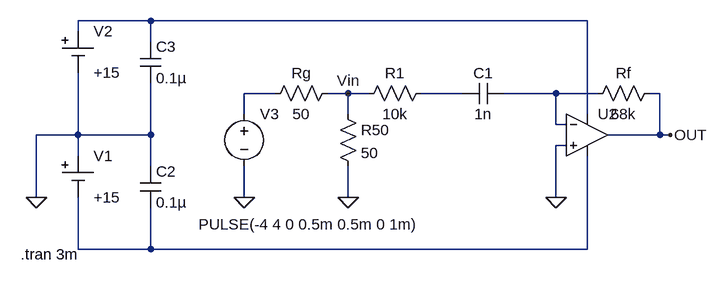
[diagram p0: schematic Circuito2.asc]
Circuito2.asc, the LTspice schematic file:
Version 4
SHEET 1 880 680
WIRE -160 -16 -272 -16
WIRE 512 -16 -160 -16
WIRE -272 0 -272 -16
WIRE -160 16 -160 -16
WIRE 32 96 -16 96
WIRE 144 96 112 96
WIRE 176 96 144 96
WIRE 320 96 256 96
WIRE 464 96 384 96
WIRE 528 96 464 96
WIRE 624 96 608 96
WIRE -16 128 -16 96
WIRE 144 128 144 96
WIRE 512 128 512 -16
WIRE 464 144 464 96
WIRE 480 144 464 144
WIRE -272 160 -272 64
WIRE -272 160 -336 160
WIRE -160 160 -160 80
WIRE -160 160 -272 160
WIRE 624 160 624 96
WIRE 624 160 544 160
WIRE 640 160 624 160
WIRE 480 176 464 176
WIRE -272 192 -272 160
WIRE -160 208 -160 160
WIRE -336 256 -336 160
WIRE -16 256 -16 208
WIRE 144 256 144 208
WIRE 464 256 464 176
WIRE -272 336 -272 256
WIRE -160 336 -160 272
WIRE -160 336 -272 336
WIRE 512 336 512 192
WIRE 512 336 -160 336
FLAG -16 256 0
FLAG 464 256 0
FLAG 144 256 0
FLAG -336 256 0
FLAG 144 96 Vin
FLAG 640 160 OUT
SYMBOL cap -176 208 R0
SYMATTR InstName C2
SYMATTR Value 0.1µ
SYMBOL Misc\\cell -272 192 R0
WINDOW 123 0 0 Left 0
WINDOW 39 0 0 Left 0
SYMATTR InstName V1
SYMATTR Value +15
SYMBOL Misc\\cell -272 0 R0
WINDOW 123 0 0 Left 0
WINDOW 39 0 0 Left 0
SYMATTR InstName V2
SYMATTR Value +15
SYMBOL res 128 80 R90
WINDOW 0 0 56 VBottom 2
WINDOW 3 32 56 VTop 2
SYMATTR InstName Rg
SYMATTR Value 50
SYMBOL res 160 112 R270
WINDOW 0 32 56 VTop 2
WINDOW 3 0 56 VBottom 2
SYMATTR InstName R1
SYMATTR Value 10k
SYMBOL res 624 80 R90
WINDOW 0 0 56 VBottom 2
WINDOW 3 32 56 VTop 2
SYMATTR InstName Rf
SYMATTR Value 68k
SYMBOL voltage -16 112 R0
WINDOW 3 -70 186 Left 2
WINDOW 123 0 0 Left 0
WINDOW 39 0 0 Left 0
SYMATTR Value PULSE(-4 4 0 0.5m 0.5m 0 1m)
SYMATTR InstName V3
SYMBOL res 128 112 R0
SYMATTR InstName R50
SYMATTR Value 50
SYMBOL cap -176 16 R0
SYMATTR InstName C3
SYMATTR Value 0.1µ
SYMBOL Opamps/UniversalOpamp2 512 160 R0
SYMATTR InstName U2
SYMBOL cap 384 80 R90
WINDOW 0 0 32 VBottom 2
WINDOW 3 32 32 VTop 2
SYMATTR InstName C1
SYMATTR Value 1n
TEXT -360 344 Left 2 !.tran 3m

The netlist it stands for:
* Circuito2.asc
C2 0 N005 0.1µ
V1 0 N005 +15
V2 N001 0 +15
Rg Vin N002 50
R1 Vin N003 10k
Rf OUT N004 68k
V3 N002 0 PULSE(-4 4 0 0.5m 0.5m 0 1m)
R50 Vin 0 50
C3 N001 0 0.1µ
XU2 0 N004 N001 N005 OUT level.2 Avol=1Meg GBW=10Meg Slew=10Meg ilimit=25m rail=0 Vos=0 phimargin=45 en=0 enk=0 in=0 ink=0 Rin=500Meg  ; pins IN+ IN- V+ V- OUT
C1 N004 N003 1n
.tran 3m
.lib UniversalOpamps2.sub
.backanno
.end